# Altium project WikiKey.PrjPcb
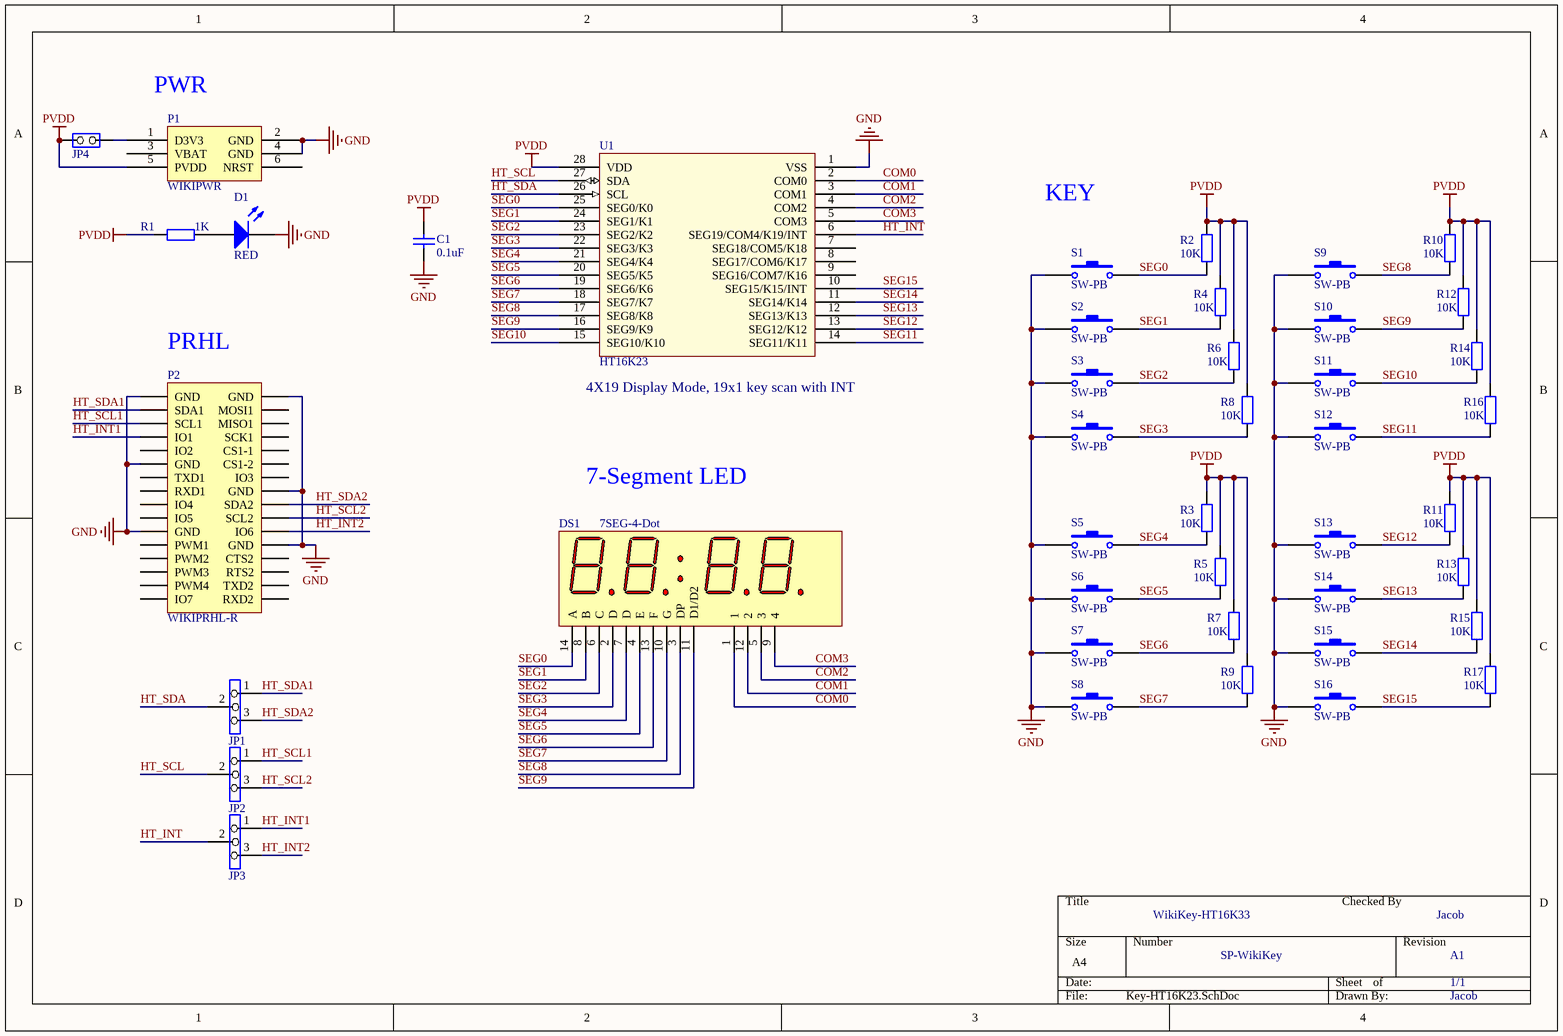
[diagram p0: Key-HT16K23.SchDoc]
1 sheet, 43 parts. Net scope: global (net labels, ports and power ports of the same name join across sheets).
Board file: Key-HT16K23.PcbDoc

## Sheet Key-HT16K23.SchDoc
size A4

### Parts
C1  0.1uF  [0603M]
D1  RED  [0603pn]
DS1  7SEG-4-Dot  [7SGLED-4-Dot-0.28]
JP1  Jumper3  [HDR1X3/2.00mm]  (value not drawn)
JP2  Jumper3  [HDR1X3/2.00mm]  (value not drawn)
JP3  Jumper3  [HDR1X3/2.00mm]  (value not drawn)
JP4  Jumper2-2  [JP2_SMD]  (value not drawn)
P1  WIKIPWR  [WIKIPWR-6P]
P2  WIKIPRHL-R  [WIKIPRHL-R]
R1  1K  [0603M]
R2  10K  [0603M]
R3  10K  [0603M]
R4  10K  [0603M]
R5  10K  [0603M]
R6  10K  [0603M]
R7  10K  [0603M]
R8  10K  [0603M]
R9  10K  [0603M]
R10  10K  [0603M]
R11  10K  [0603M]
R12  10K  [0603M]
R13  10K  [0603M]
R14  10K  [0603M]
R15  10K  [0603M]
R16  10K  [0603M]
R17  10K  [0603M]
S1  SW-PB  [KEY-4.5X4.5-SMD]
S2  SW-PB  [KEY-4.5X4.5-SMD]
S3  SW-PB  [KEY-4.5X4.5-SMD]
S4  SW-PB  [KEY-4.5X4.5-SMD]
S5  SW-PB  [KEY-4.5X4.5-SMD]
S6  SW-PB  [KEY-4.5X4.5-SMD]
S7  SW-PB  [KEY-4.5X4.5-SMD]
S8  SW-PB  [KEY-4.5X4.5-SMD]
S9  SW-PB  [KEY-4.5X4.5-SMD]
S10  SW-PB  [KEY-4.5X4.5-SMD]
S11  SW-PB  [KEY-4.5X4.5-SMD]
S12  SW-PB  [KEY-4.5X4.5-SMD]
S13  SW-PB  [KEY-4.5X4.5-SMD]
S14  SW-PB  [KEY-4.5X4.5-SMD]
S15  SW-PB  [KEY-4.5X4.5-SMD]
S16  SW-PB  [KEY-4.5X4.5-SMD]
U1  HT16K23  [SO28_M]

### Nets
GND: C1.1 D1.2(K) P1.2(GND) P1.4(GND) P2.1(GND) P2.2(GND) P2.11(GND) P2.16(GND) P2.21(GND) P2.24(GND) S1.1 S2.1 S3.1 S4.1 S5.1 S6.1 S7.1 S8.1 S9.1 S10.1 S11.1 S12.1 S13.1 S14.1 S15.1 S16.1 U1.1(VSS)
PVDD: C1.2 JP4.2(NO) P1.5(PVDD) R1.2 R2.1 R3.1 R4.1 R5.1 R6.1 R7.1 R8.1 R9.1 R10.1 R11.1 R12.1 R13.1 R14.1 R15.1 R16.1 R17.1 U1.28(VDD)
COM0: DS1.1 U1.2(COM0)
COM1: DS1.12(2) U1.3(COM1)
COM2: DS1.5(3) U1.4(COM2)
COM3: DS1.9(4) U1.5(COM3)
HT_INT: JP3.2 U1.6(SEG19/COM4/K19/INT)
HT_INT1: JP3.1 P2.7(IO1)
HT_INT2: JP3.3 P2.22(IO6)
HT_SCL: JP2.2 U1.27(SDA)
HT_SCL1: JP2.1 P2.5(SCL1)
HT_SCL2: JP2.3 P2.20(SCL2)
HT_SDA: JP1.2 U1.26(SCL)
HT_SDA1: JP1.1 P2.3(SDA1)
HT_SDA2: JP1.3 P2.18(SDA2)
SEG0: DS1.14(A) R2.2 S1.2 U1.25(SEG0/K0)
SEG1: DS1.8(B) R4.2 S2.2 U1.24(SEG1/K1)
SEG2: DS1.6(C) R6.2 S3.2 U1.23(SEG2/K2)
SEG3: DS1.2(D) R8.2 S4.2 U1.22(SEG3/K3)
SEG4: DS1.7(D) R3.2 S5.2 U1.21(SEG4/K4)
SEG5: DS1.4(E) R5.2 S6.2 U1.20(SEG5/K5)
SEG6: DS1.13(F) R7.2 S7.2 U1.19(SEG6/K6)
SEG7: DS1.10(G) R9.2 S8.2 U1.18(SEG7/K7)
SEG8: DS1.3(DP) R10.2 S9.2 U1.17(SEG8/K8)
SEG9: DS1.11(D1/D2) R12.2 S10.2 U1.16(SEG9/K9)
SEG10: R14.2 S11.2 U1.15(SEG10/K10)
SEG11: R16.2 S12.2 U1.14(SEG11/K11)
SEG12: R11.2 S13.2 U1.13(SEG12/K12)
SEG13: R13.2 S14.2 U1.12(SEG13/K13)
SEG14: R15.2 S15.2 U1.11(SEG14/K14)
SEG15: R17.2 S16.2 U1.10(SEG15/K15/INT)
NetD1_1: D1.1(A) R1.1
NetJP4_1: JP4.1(COMMON) P1.1(D3V3)

Not connected (* = marked no-connect by the designer): P1 3(VBAT) 6(NRST); P2 4(MOSI1) 6(MISO1) 8(SCK1) 9(IO2) 10(CS1-1) 12(CS1-2) 13(TXD1) 14(IO3) 15(RXD1) 17(IO4) 19(IO5) 23(PWM1) 25(PWM2) 26(CTS2) 27(PWM3) 28(RTS2) 29(PWM4) 30(TXD2) 31(IO7) 32(RXD2); U1 7(SEG18/COM5/K18) 8(SEG17/COM6/K17) 9(SEG16/COM7/K16)

### Notes on the sheet
- (near P1) PWR
- KEY
- (near P2) PRHL
- (near U1) 4X19 Display Mode, 19x1 key scan with INT
- 7-Segment LED
- WikiKey-HT16K33
- Checked By
- Jacob
- SP-WikiKey
- A1
- 1/1

### Library data of the parts
C1 = Cap: Capacitor; Published: 8-Jun-2000; LatestRevisionDate: 17-Jul-2002; LatestRevisionNote: Re-released for DXP Platform.; PackageReference: RAD-0.3; Publisher: Altium Limited; Value: 0.1uF
D1 = LED0: Typical INFRARED GaAs LED; Published: 8-Jun-2000; LatestRevisionDate: 08-Jul-2005; LatestRevisionNote: Mech Layer 1 removed.; PackageReference: LED-0; Publisher: Altium Limited
DS1 = 7SEG-4-Dot: Black Surface HER 7-Segment Display; MinimumIntensity: 360 ucd; Note: IF = 5 mA; Colour: High Efficiency Red (HER); Note: Pins 1 and 6 are redundant Cathodes.; Published: 8-Jun-2000; LatestRevisionDate: 17-Dec-2003; LatestRevisionNote: Schematic revised, PCB Footprint replaced.; DatasheetDocument: 19-Feb-2002; PackageDocument: 19-Feb-2002; PackageReference: LEDDIP-10; Publisher: Altium Limited; ComponentLink1Description: Manufacturer Link; ComponentLink1URL: http://www.agilent.com/
JP4 = Jumper2-2: Jumper2
P1 = WIKIPWR: PWR HDR
P2 = WIKIPRHL-R: Header, 16-Pin, Dual row; LatestRevisionDate: 17-Jul-2002; LatestRevisionNote: Re-released for DXP Platform.; Publisher: Altium Limited
R1-R17 = Res2: Resistor; Published: 8-Jun-2000; LatestRevisionDate: 17-Jul-2002; LatestRevisionNote: Re-released for DXP Platform.; PackageReference: AXIAL-0.4; Publisher: Altium Limited
  R1: Value: 1K
  R2-R17: Value: 10K
S1-S16 = SW-PB: Switch; Published: 24-Mar-1999; LatestRevisionDate: 17-Jul-2002; LatestRevisionNote: Re-released for DXP Platform.; PackageReference: SPST-2; Publisher: Altium Limited
U1 = HT16K23: LCD Driver with keyscan